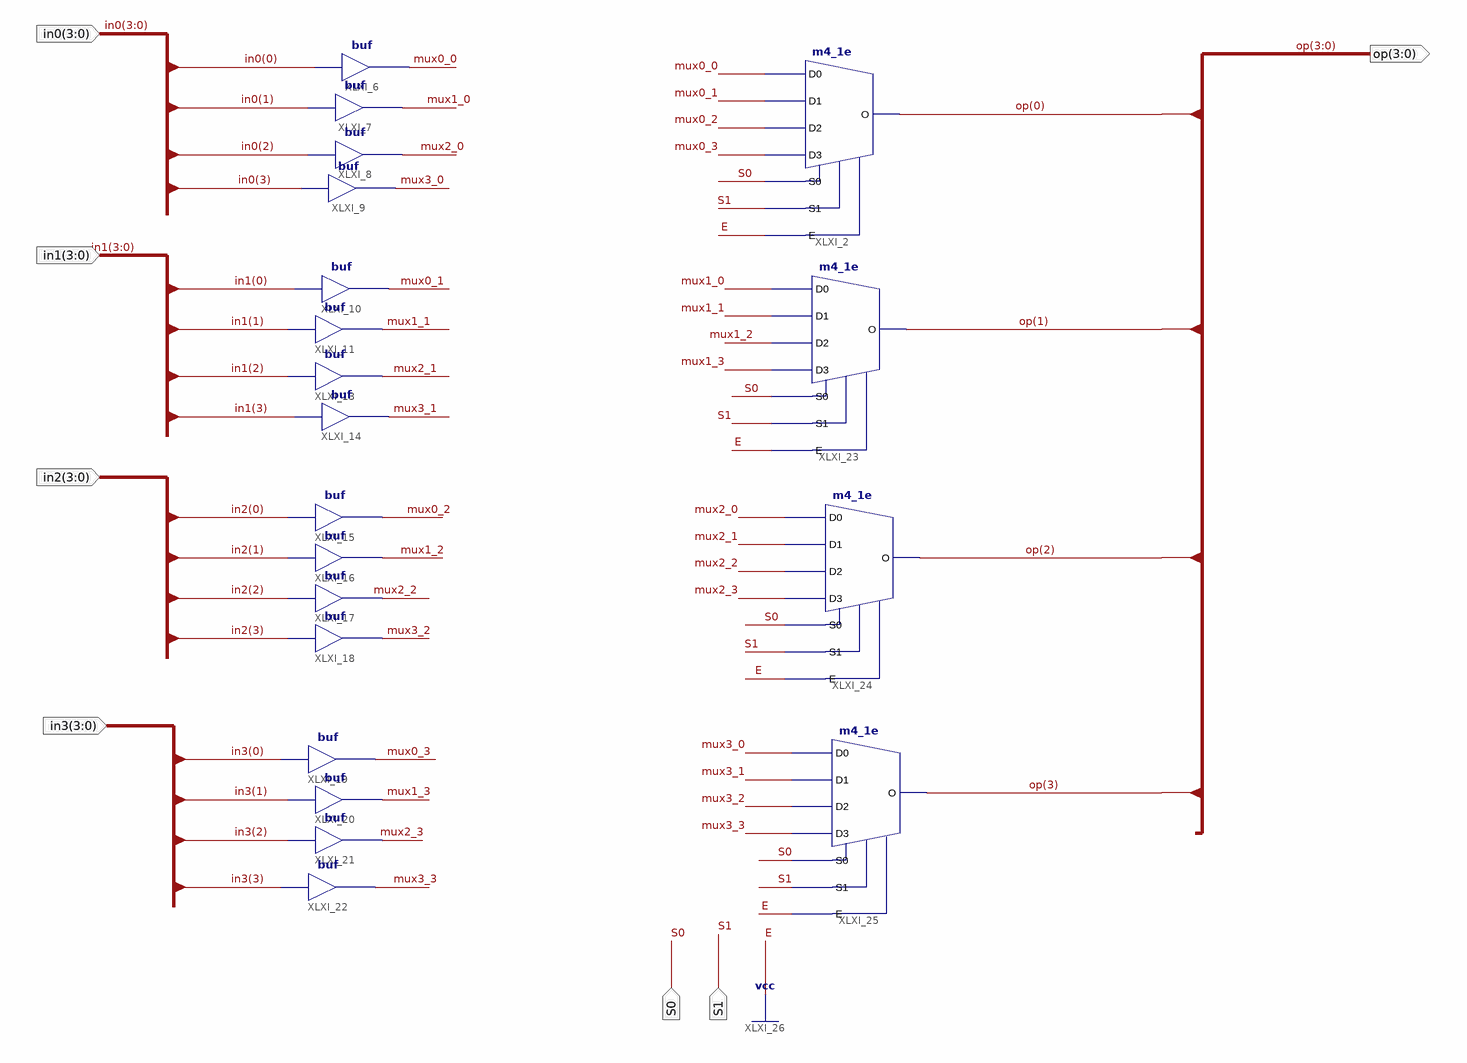
[diagram p0: schematic sheet 1]
// Xilinx ISE schematic negative_mux.sch (spartan3e) as structural Verilog: 20 symbols, 7 ports
module negative_mux (
  input  [3:0] in0,
  input  [3:0] in1,
  input  [3:0] in2,
  input  [3:0] in3,
  input  S0,
  input  S1,
  output [3:0] op
);

  wire mux0_0, mux0_1, mux0_2, mux0_3, mux1_0, mux1_1, mux1_2, mux1_3, mux2_0, mux2_1, mux2_2, mux2_3,
       mux3_0, mux3_1, mux3_2, mux3_3;

  m4_1e XLXI_2 (.D0(mux0_0), .D1(mux0_1), .D2(mux0_2), .D3(mux0_3), .E(1'b1), .S0(S0), .S1(S1), .O(op[0]));
  buf XLXI_6 (mux0_0, in0[0]);
  buf XLXI_7 (mux1_0, in0[1]);
  buf XLXI_8 (mux2_0, in0[2]);
  buf XLXI_9 (mux3_0, in0[3]);
  buf XLXI_10 (mux0_1, in1[0]);
  buf XLXI_11 (mux1_1, in1[1]);
  buf XLXI_13 (mux2_1, in1[2]);
  buf XLXI_14 (mux3_1, in1[3]);
  buf XLXI_15 (mux0_2, in2[0]);
  buf XLXI_16 (mux1_2, in2[1]);
  buf XLXI_17 (mux2_2, in2[2]);
  buf XLXI_18 (mux3_2, in2[3]);
  buf XLXI_19 (mux0_3, in3[0]);
  buf XLXI_20 (mux1_3, in3[1]);
  buf XLXI_21 (mux2_3, in3[2]);
  buf XLXI_22 (mux3_3, in3[3]);
  m4_1e XLXI_23 (.D0(mux1_0), .D1(mux1_1), .D2(mux1_2), .D3(mux1_3), .E(1'b1), .S0(S0), .S1(S1), .O(op[1]));
  m4_1e XLXI_24 (.D0(mux2_0), .D1(mux2_1), .D2(mux2_2), .D3(mux2_3), .E(1'b1), .S0(S0), .S1(S1), .O(op[2]));
  m4_1e XLXI_25 (.D0(mux3_0), .D1(mux3_1), .D2(mux3_2), .D3(mux3_3), .E(1'b1), .S0(S0), .S1(S1), .O(op[3]));
endmodule
